# EAGLE design Skaarhoj BI8-1x8slim (EAGLE 6.4)
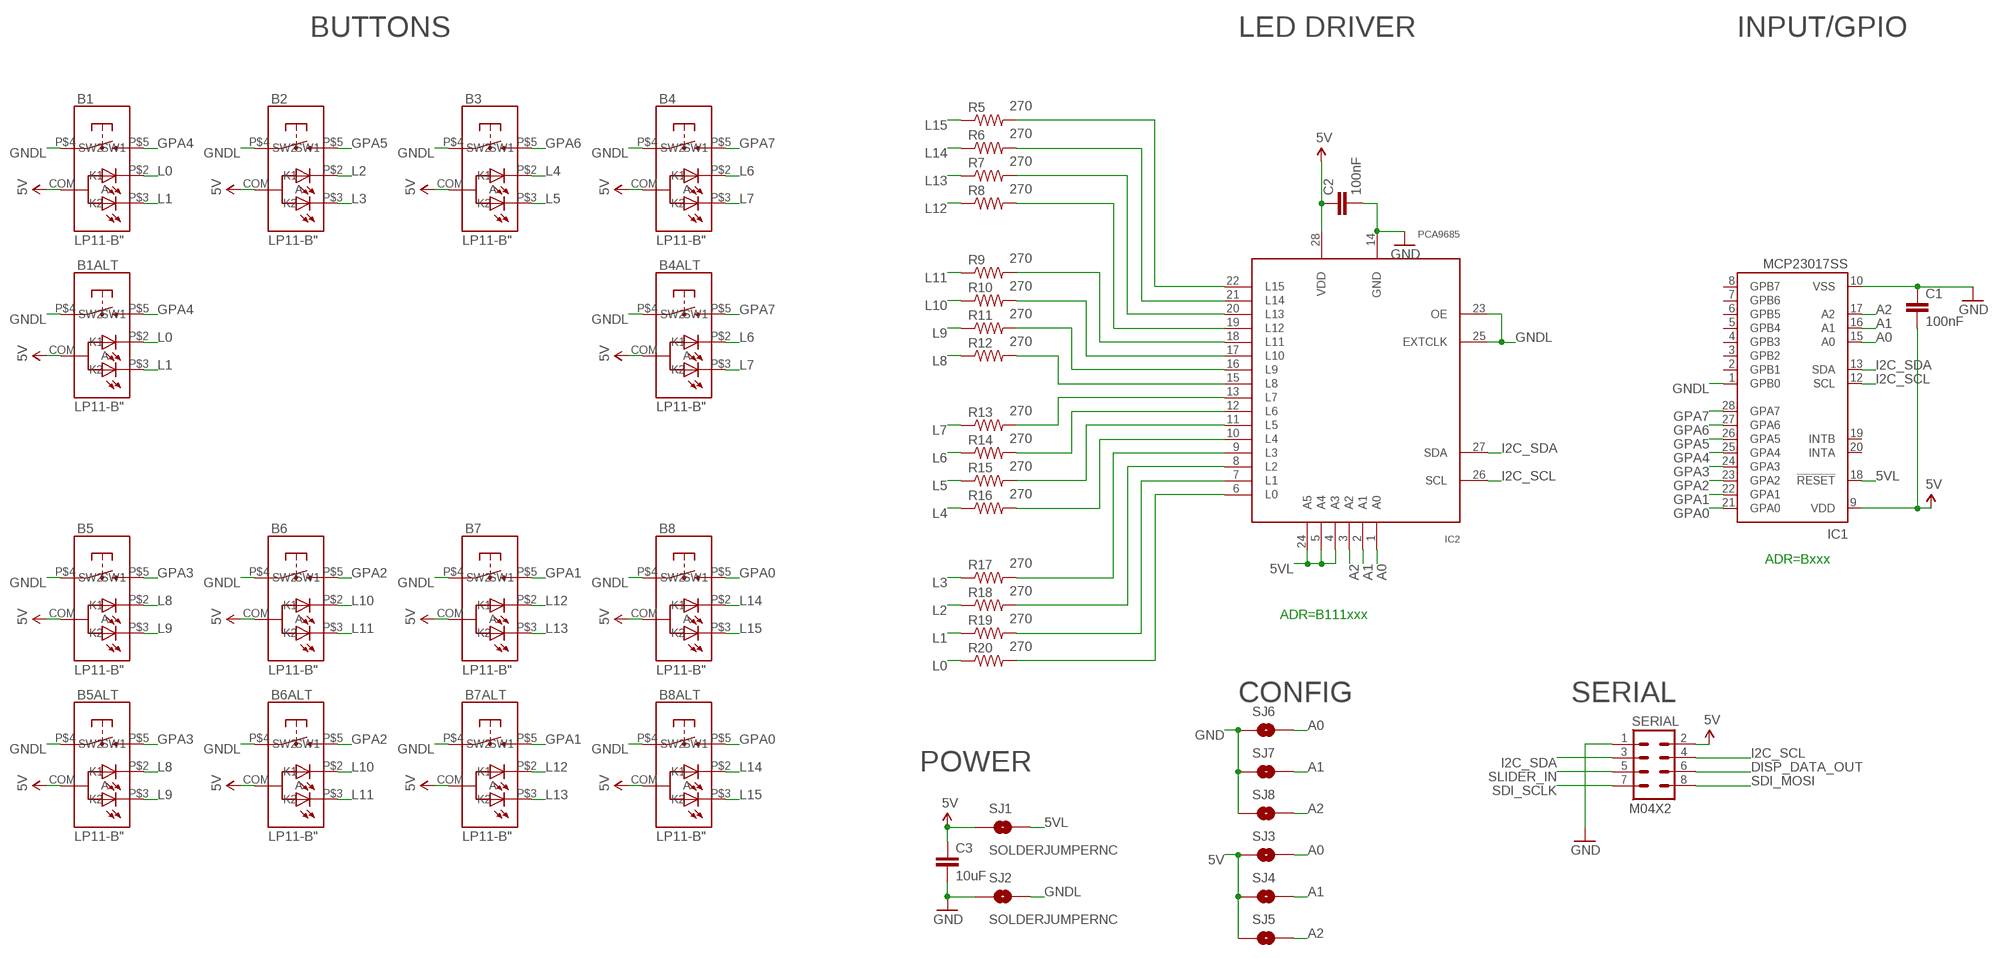
[diagram p0: schematic, sheet 1]

## Parts
B1  LP11-B"  [LP11]
B1ALT  LP11-B"  [LP11]
B2  LP11-B"  [LP11]
B3  LP11-B"  [LP11]
B4  LP11-B"  [LP11]
B4ALT  LP11-B"  [LP11]
B5  LP11-B"  [LP11]
B5ALT  LP11-B"  [LP11]
B6  LP11-B"  [LP11]
B6ALT  LP11-B"  [LP11]
B7  LP11-B"  [LP11]
B7ALT  LP11-B"  [LP11]
B8  LP11-B"  [LP11]
B8ALT  LP11-B"  [LP11]
C1  100nF  CAP0603-CAP  [0603-CAP]
C2  100nF  CAP0603-CAP  [0603-CAP]
C3  10uF  CAP0805  [0805]
IC1  MCP23017SS  [SSOP28]
IC2  PCA9685  [TSSOP28]
R5  270  RESISTOR0603-RES  [0603-RES]
R6  270  RESISTOR0603-RES  [0603-RES]
R7  270  RESISTOR0603-RES  [0603-RES]
R8  270  RESISTOR0603-RES  [0603-RES]
R9  270  RESISTOR0603-RES  [0603-RES]
R10  270  RESISTOR0603-RES  [0603-RES]
R11  270  RESISTOR0603-RES  [0603-RES]
R12  270  RESISTOR0603-RES  [0603-RES]
R13  270  RESISTOR0603-RES  [0603-RES]
R14  270  RESISTOR0603-RES  [0603-RES]
R15  270  RESISTOR0603-RES  [0603-RES]
R16  270  RESISTOR0603-RES  [0603-RES]
R17  270  RESISTOR0603-RES  [0603-RES]
R18  270  RESISTOR0603-RES  [0603-RES]
R19  270  RESISTOR0603-RES  [0603-RES]
R20  270  RESISTOR0603-RES  [0603-RES]
SERIAL  M04X2  [2X4]
SJ1  SOLDERJUMPERNC  [SJ_2S]
SJ2  SOLDERJUMPERNC  [SJ_2S]
SJ3  SOLDERJUMPERNC  [SJ_2S]
SJ4  SOLDERJUMPERNC  [SJ_2S]
SJ5  SOLDERJUMPERNC  [SJ_2S]
SJ6  SOLDERJUMPERNC  [SJ_2S]
SJ7  SOLDERJUMPERNC  [SJ_2S]
SJ8  SOLDERJUMPERNC  [SJ_2S]

## Nets
5V [Power]: B1.COM(A) B1ALT.COM(A) B2.COM(A) B3.COM(A) B4.COM(A) B4ALT.COM(A) B5.COM(A) B5ALT.COM(A) B6.COM(A) B6ALT.COM(A) B7.COM(A) B7ALT.COM(A) B8.COM(A) B8ALT.COM(A) C1.2 C2.1 C3.1 IC1.9(VDD) IC2.28(VDD) SERIAL.2 SJ1.1 SJ3.1 SJ4.1 SJ5.1
5VL: IC1.18(!RESET) IC2.4(A3) IC2.5(A4) IC2.24(A5) SJ1.2
A0: IC1.15(A0) IC2.1(A0) SJ3.2 SJ6.2
A1: IC1.16(A1) IC2.2(A1) SJ4.2 SJ7.2
A2: IC1.17(A2) IC2.3(A2) SJ5.2 SJ8.2
DISP_DATA_OUT: SERIAL.6
GND [Power]: C1.1 C2.2 C3.2 IC1.10(VSS) IC2.14(GND) SERIAL.1 SJ2.1 SJ6.1 SJ7.1 SJ8.1
GNDL: B1.P$4(SW1) B1ALT.P$4(SW1) B2.P$4(SW1) B3.P$4(SW1) B4.P$4(SW1) B4ALT.P$4(SW1) B5.P$4(SW1) B5ALT.P$4(SW1) B6.P$4(SW1) B6ALT.P$4(SW1) B7.P$4(SW1) B7ALT.P$4(SW1) B8.P$4(SW1) B8ALT.P$4(SW1) IC1.1(GPB0) IC2.23(OE) IC2.25(EXTCLK) SJ2.2
GPA0: B8.P$5(SW2) B8ALT.P$5(SW2) IC1.21(GPA0)
GPA1: B7.P$5(SW2) B7ALT.P$5(SW2) IC1.22(GPA1)
GPA2: B6.P$5(SW2) B6ALT.P$5(SW2) IC1.23(GPA2)
GPA3: B5.P$5(SW2) B5ALT.P$5(SW2) IC1.24(GPA3)
GPA4: B1.P$5(SW2) B1ALT.P$5(SW2) IC1.25(GPA4)
GPA5: B2.P$5(SW2) IC1.26(GPA5)
GPA6: B3.P$5(SW2) IC1.27(GPA6)
GPA7: B4.P$5(SW2) B4ALT.P$5(SW2) IC1.28(GPA7)
I2C_SCL: IC1.12(SCL) IC2.26(SCL) SERIAL.4
I2C_SDA: IC1.13(SDA) IC2.27(SDA) SERIAL.3
L0: B1.P$2(K1) B1ALT.P$2(K1) R20.1
L1: B1.P$3(K2) B1ALT.P$3(K2) R19.1
L2: B2.P$2(K1) R18.1
L3: B2.P$3(K2) R17.1
L4: B3.P$2(K1) R16.1
L5: B3.P$3(K2) R15.1
L6: B4.P$2(K1) B4ALT.P$2(K1) R14.1
L7: B4.P$3(K2) B4ALT.P$3(K2) R13.1
L8: B5.P$2(K1) B5ALT.P$2(K1) R12.1
L9: B5.P$3(K2) B5ALT.P$3(K2) R11.1
L10: B6.P$2(K1) B6ALT.P$2(K1) R10.1
L11: B6.P$3(K2) B6ALT.P$3(K2) R9.1
L12: B7.P$2(K1) B7ALT.P$2(K1) R8.1
L13: B7.P$3(K2) B7ALT.P$3(K2) R7.1
L14: B8.P$2(K1) B8ALT.P$2(K1) R6.1
L15: B8.P$3(K2) B8ALT.P$3(K2) R5.1
N$4: IC2.13(L7) R13.2
N$5: IC2.12(L6) R14.2
N$7: IC2.11(L5) R15.2
N$9: IC2.10(L4) R16.2
N$10: IC2.9(L3) R17.2
N$11: IC2.8(L2) R18.2
N$12: IC2.7(L1) R19.2
N$19: IC2.6(L0) R20.2
N$20: IC2.15(L8) R12.2
N$21: IC2.16(L9) R11.2
N$22: IC2.17(L10) R10.2
N$23: IC2.18(L11) R9.2
N$24: IC2.19(L12) R8.2
N$25: IC2.20(L13) R7.2
N$26: IC2.21(L14) R6.2
N$27: IC2.22(L15) R5.2
SDI_MOSI: SERIAL.8
SDI_SCLK: SERIAL.7
SLIDER_IN: SERIAL.5
Unconnected: IC1.2(GPB1) IC1.3(GPB2) IC1.4(GPB3) IC1.5(GPB4) IC1.6(GPB5) IC1.7(GPB6) IC1.8(GPB7) IC1.19(INTB) IC1.20(INTA)

## Notes on the sheet
- BUTTONS | LED DRIVER | INPUT/GPIO
- ADR=Bxxx
- ADR=B111xxx
- CONFIG | SERIAL
- POWER

## Library data of the parts
B1 B1ALT B2-B4 B4ALT B5 B5ALT B6 B6ALT B7 B7ALT B8 B8ALT = SKAARHOJ:LP11-B
C1-C3 = SparkFun:CAP: Capacitor Standard 0603 ceramic capacitor, and 0.1" leaded capacitor.
IC1 = microchip:MCP23017: http://ww1.microchip.com/downloads/en/DeviceDoc/21952a.pdf Source: http://ww1.microchip.com/downloads/en/DeviceDoc/21952a.pdf; MF: MICROCHIP; MPN: MCP23017-E/SS; OC_FARNELL: 1467674; OC_NEWARK: 31K2960
IC2 = wsmith:PCA9685
R5-R20 = SparkFun:RESISTOR: Resistor Basic schematic elements and footprints for 0603, 1206, and PTH resistors.
SERIAL = SparkFun:M04X2
SJ1-SJ8 = SparkFun:SOLDERJUMPER: Solder Jumper Standard SMD solder jumper. Used to automate production. Two varients : Normally Open and Normally Closed are the same, but have different paste layers. NC will have a large amount of paste and should jumper during reflow.

## Net classes
0 default: width 0.203 mm, drill 0.305 mm, clearance 0.203 mm
1 Power: width 0.305 mm, drill 0.61 mm, clearance 0.203 mm

## Board
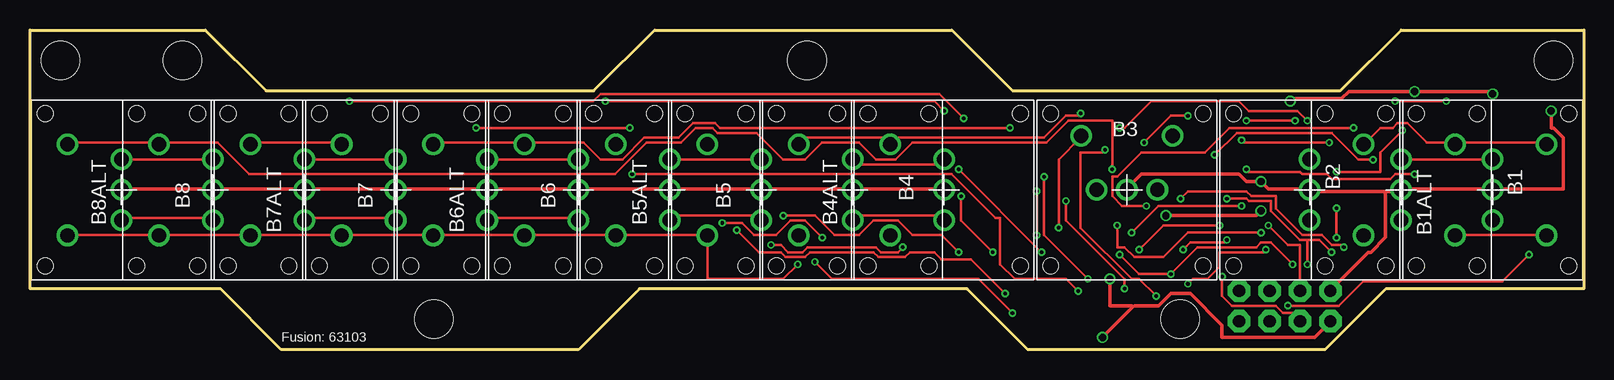
[diagram p1: board, top side]
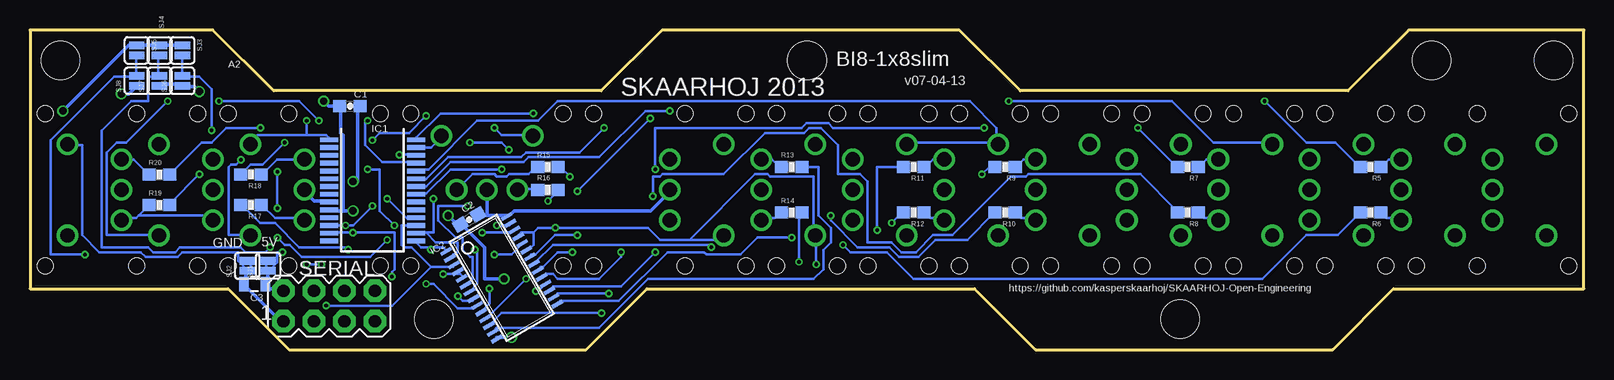
[diagram p2: board, bottom side, seen from below]

Size 129.54 x 26.67 mm. Coordinates in mm from the lower left corner, seen from the top.
Outline: 0,26.67 14.61,26.67 19.68,21.59 46.99,21.59 52.07,26.67 76.83,26.67 81.92,21.59 109.22,21.59 114.3,26.67 129.54,26.67 129.54,5.08 113.03,5.08 107.95,0 83.19,0 78.11,5.08 50.8,5.08 45.72,0 20.95,0 15.88,5.08 0,5.08 0,26.67
Copper layers (1*16): Top 0.035mm / dielectric 1.5mm / Bottom 0.035mm
Design rules "Fusion_eagle_rule_v1.1": minimum track width 6mil, minimum drill 12mil, track to track 6mil, track to pad 6mil, pad to pad 6mil, via to via 6mil, smd to smd 0mil, copper to edge 10mil, drill to drill 10mil, minimum pad ring 10mil, minimum via ring 6mil, stop-mask expansion 2mil, vias tented up to drill 100mil, thermal gap 10mil
Holes 3.2 mm at 2.54,24.13 33.66,2.54 95.89,2.54 64.77,24.13 127,24.13 12.7,24.13

### Footprints (pad centres in the part's own frame; a part is rotated, then mirrored left to right if it is on the bottom)
LP11 = drill 1.2: COM 0,0; P$2 0,2.54; P$3 0,-2.54; P$4 4.5,3.81; P$5 4.5,-3.81 | hole 1.3: -6.35,6.35; 6.35,6.35; 6.35,-6.35; -6.35,-6.35
0603-CAP = smd 1.1 x 1: 1 -0.85,0; 2 0.85,0
0805 = smd 0.8 x 1.2: 1 -0.9,0; 2 0.9,0
SSOP28 = smd 0.4 x 1.5: 1 -4.225,-3.625; 2 -3.575,-3.625; 3 -2.925,-3.625; 4 -2.275,-3.625; 5 -1.625,-3.625; 6 -0.975,-3.625; 7 -0.325,-3.625; 8 0.325,-3.625; 9 0.975,-3.625; 10 1.625,-3.625; 11 2.275,-3.625; 12 2.925,-3.625; 13 3.575,-3.625; 14 4.225,-3.625; 15 4.225,3.625; 16 3.575,3.625; 17 2.925,3.625; 18 2.275,3.625; 19 1.625,3.625; 20 0.975,3.625; 21 0.325,3.625; 22 -0.325,3.625; 23 -0.975,3.625; 24 -1.625,3.625; 25 -2.275,3.625; 26 -2.925,3.625; 27 -3.575,3.625; 28 -4.225,3.625
TSSOP28 = smd 0.305 x 0.991: 1 -4.225,-2.918; 2 -3.575,-2.918; 3 -2.925,-2.918; 4 -2.275,-2.918; 5 -1.625,-2.918; 6 -0.975,-2.918; 7 -0.325,-2.918; 8 0.325,-2.918; 9 0.975,-2.918; 10 1.625,-2.918; 11 2.275,-2.918; 12 2.925,-2.918; 13 3.575,-2.918; 14 4.225,-2.918; 15 4.225,2.918; 16 3.575,2.918; 17 2.925,2.918; 18 2.275,2.918; 19 1.625,2.918; 20 0.975,2.918; 21 0.325,2.918; 22 -0.325,2.918; 23 -0.975,2.918; 24 -1.625,2.918; 25 -2.275,2.918; 26 -2.925,2.918; 27 -3.575,2.918; 28 -4.225,2.918
0603-RES = smd 1.1 x 1: 1 -0.85,0; 2 0.85,0
2X4 = drill 1.016 pad 1.88 octagon: 1 -3.81,-1.27; 2 -3.81,1.27; 3 -1.27,-1.27; 4 -1.27,1.27; 5 1.27,-1.27; 6 1.27,1.27; 7 3.81,-1.27; 8 3.81,1.27
SJ_2S = smd 0.635 x 1.27: 1 -0.412,0; 2 0.412,0

### Placement (x,y rotation side)
B1  121.92,13.34 0 top
B1ALT  114.3,13.34 0 top
B2  106.68,13.34 0 top
B3  91.44,13.34 90 top
B4  76.2,13.34 180 top
B4ALT  68.58,13.34 180 top
B5  60.96,13.34 180 top
B5ALT  53.34,13.34 180 top
B6  45.72,13.34 180 top
B6ALT  38.1,13.34 180 top
B7  30.48,13.34 180 top
B7ALT  22.86,13.34 180 top
B8  15.24,13.34 180 top
B8ALT  7.62,13.34 180 top
C1  102.87,20.32 0 bottom
C2  92.94,10.85 210 bottom
C3  110.82,5.46 180 bottom
IC1  100.99,13.28 270 bottom
IC2  90.22,5.99 300 bottom
R5  17.78,15.24 180 bottom
R6  17.78,11.43 180 bottom
R7  33.02,15.24 180 bottom
R8  33.02,11.43 180 bottom
R9  48.26,15.24 180 bottom
R10  48.26,11.43 180 bottom
R11  55.88,15.24 180 bottom
R12  55.88,11.43 180 bottom
R13  66.04,15.24 0 bottom
R14  66.04,11.43 0 bottom
R15  86.36,15.24 0 bottom
R16  86.36,13.34 0 bottom
R17  111.12,12.06 180 bottom
R18  111.12,14.61 180 bottom
R19  118.75,12.06 0 bottom
R20  118.75,14.61 0 bottom
SERIAL  104.6,3.63 0 bottom
SJ1  109.68,6.99 90 bottom
SJ2  111.43,6.99 90 bottom
SJ3  116.84,24.97 270 bottom
SJ4  118.75,24.97 270 bottom
SJ5  120.65,24.97 270 bottom
SJ6  116.84,22.43 90 bottom
SJ7  118.75,22.43 90 bottom
SJ8  120.65,22.43 90 bottom

### Tracks (layer width: path | path; a pad name or v marks a point on that pad's centre or on a via)
5V  (via drill 0.61)
  Top 0.305: B3.COM 91.44,13.41 92.66,14.63 100.79,14.63 101.4,14.02 v102.62,14.02 103.23,13.41 106.68,13.41 B2.COM 106.68,13.21 112.98,13.21 | v126.8,19.91 126.8,18.49 127,18.49 127.81,17.68 127.81,13.41 121.92,13.41 | 121.92,13.41 114.4,13.41 B1ALT.COM 114.2,13.21 112.98,13.21 | 121.92,13.41 B1.COM | 112.98,13.21 112.98,9.35 111.76,8.13 111.56,8.13 108.51,5.08 SERIAL.2 | B4.COM 76.2,13.41 68.68,13.41 B4ALT.COM 68.48,13.41 60.96,13.41 | 60.96,13.41 53.44,13.41 B5ALT.COM 53.24,13.41 45.72,13.41 | 45.72,13.41 38.2,13.41 B6ALT.COM 38,13.41 30.48,13.41 | 15.24,13.41 7.72,13.41 B8ALT.COM | 30.48,13.41 22.96,13.41 B7ALT.COM 22.76,13.41 15.24,13.41 | 15.24,13.41 B8.COM | 30.48,13.41 B7.COM | 45.72,13.41 B6.COM | 60.96,13.41 B5.COM
  Bottom 0.305: 91.44,11.18 92.05,11.18 C2.1 | 91.44,11.18 89.81,11.18 IC2.28 89.61,11.18 89.2,11.58 77.83,11.58 76.2,13.21 B4.COM | B3.COM 91.44,11.18 | v102.62,14.02 102.21,14.02 102.21,20.32 C1.2 | IC1.9 104.65,12.39 105.87,12.39 106.68,13.21 B2.COM | SJ1.1 109.73,6.5 109.73,5.49 C3.1 109.73,5.28 109.53,5.08 108.51,5.08 SERIAL.2 | SJ3.1 116.84,25.4 118.67,25.4 SJ4.1 118.87,25.4 120.5,25.4 SJ5.1 120.7,25.4 121.31,25.4 v126.8,19.91
5VL  (via drill 0.3)
  Top 0.203: v90.83,7.92 92.46,6.3 v95.1,6.3 97.33,8.53 102.21,8.53 102.62,8.94 103.43,8.94 v105.26,7.11 | v108.51,8.13 107.49,9.14 106.48,9.14 | 106.48,9.14 105.87,9.14 103.43,11.58 103.43,12.39 101.6,12.39 101.4,12.6 v99.77,12.6 | 106.48,9.14 v106.48,7.11
  Bottom 0.203: 93.67,6.3 93.88,6.5 IC2.4 | 93.67,6.3 93.47,6.1 IC2.5 | v90.83,7.92 89.41,7.92 88.59,8.74 IC2.24 | 93.67,6.3 v95.1,6.3 | v108.51,8.13 108.92,8.13 108.92,7.29 109.86,6.35 109.86,7.22 SJ1.2 109.53,7.52 | v99.77,12.6 98.15,10.97 97.54,10.97 IC1.18 | v106.48,7.11 v105.26,7.11
A0  (via drill 0.3)
  Top 0.203: v114.4,18.29 112.57,16.46 112.57,14.83 v108.92,14.83 | v108.92,9.35 v108.92,11.79 | v99.77,9.14 99.57,8.94 96.72,8.94 v96.11,8.33
  Bottom 0.203: SJ3.2 SJ6.2 116.84,22.76 115.42,22.76 114.4,21.74 v114.4,18.29 | 96.11,8.53 96.93,8.53 97.33,8.94 IC1.15 | 96.11,8.53 95.1,8.53 94.89,8.33 IC2.1 | v108.92,11.79 v108.92,14.83 | v108.92,9.35 108.31,8.74 107.9,8.74 106.88,7.72 101.19,7.72 v99.77,9.14 | 96.11,8.53 v96.11,8.33
A1  (via drill 0.3)
  Top 0.203: v109.53,8.53 109.32,8.74 108.51,8.74 107.7,9.55 106.07,9.55 103.83,11.79 103.83,12.8 101.8,12.8 101.4,13.21 96.52,13.21 v95.91,12.6
  Bottom 0.203: SJ4.2 118.87,24.38 118.87,22.96 SJ7.2 118.87,22.76 119.48,22.76 119.69,22.55 119.69,20.73 121.11,20.73 123.55,18.29 123.55,8.53 119.69,8.53 119.28,8.13 117.45,8.13 117.04,8.53 111.96,8.53 111.56,8.13 109.93,8.13 v109.53,8.53 | 96.52,9.75 95.71,8.94 93.88,8.94 93.88,8.13 94.08,7.92 94.28,7.92 94.49,7.72 IC2.2 | 96.52,9.75 97.33,9.75 IC1.16 | v95.91,12.6 95.91,9.75 96.52,9.75
A2  (via drill 0.3)
  Top 0.203: v124.97,7.92 122.73,5.69 111.15,5.69 109.12,3.66 v104.85,3.66
  Bottom 0.203: SJ5.2 120.7,24.38 120.7,22.96 SJ8.2 120.7,22.76 122.53,22.76 127.81,17.48 127.81,7.92 v124.97,7.92 | 96.11,6.91 94.28,6.91 IC2.3 | 96.11,6.91 97.74,8.53 98.35,8.53 98.55,8.74 98.55,10.36 97.54,10.36 IC1.17 | v104.85,3.66 99.36,3.66 96.11,6.91
GND  (via drill 0.61)
  Top 0.305: v121.92,21.34 121.72,21.54 v115.42,21.54 109.93,21.54 109.32,20.93 105.26,20.93 v105.05,20.73 | 91.95,3.56 92.05,3.66 94.08,3.66 95.1,4.67 96.72,4.67 99.36,2.03 99.36,1.02 107.09,1.02 108.31,2.23 SERIAL.1 | 91.95,3.56 v89.41,1.02 | v90.02,5.89 90.02,3.66 91.85,3.66 91.95,3.56 | v102.62,11.58 102.21,11.18 v94.69,11.18
  Bottom 0.305: SJ7.1 118.67,22.15 116.84,22.15 SJ6.1 116.84,21.95 115.82,21.95 v115.42,21.54 | v121.92,21.34 121.31,21.34 120.7,21.95 SJ8.1 | 103.43,11.58 103.43,17.88 103.63,18.09 103.63,20.32 C1.1 104.65,20.32 v105.05,20.73 | 103.43,11.58 104.44,11.58 IC1.10 | SJ2.1 111.56,6.5 111.56,5.49 C3.2 111.56,5.28 108.71,2.44 108.51,2.44 SERIAL.1 | v89.41,1.02 90.63,1.02 IC2.14 | v90.02,5.89 91.64,5.89 91.64,8.53 93.47,10.36 C2.2 93.67,10.57 94.08,10.57 v94.69,11.18 | v102.62,11.58 103.43,11.58
GNDL  (via drill 0.3)
  Top 0.203: B8ALT.P$4 3.25,9.55 10.57,9.55 B8.P$4 10.77,9.55 18.29,9.55 B7ALT.P$4 18.49,9.55 25.81,9.55 B7.P$4 26.01,9.55 33.53,9.55 B6ALT.P$4 33.73,9.55 41.05,9.55 B6.P$4 41.25,9.55 48.77,9.55 B5ALT.P$4 48.97,9.55 56.29,9.55 B5.P$4 56.49,9.35 56.49,5.89 62.79,5.89 v64.01,7.11 | B1.P$4 126.39,17.27 118.87,17.27 B1ALT.P$4 118.67,17.27 116.43,17.27 114.81,18.9 114,18.9 113.59,18.49 112.57,18.49 111.35,17.27 B2.P$4 | v85.75,10.16 85.75,15.85 87.58,17.68 B3.P$4 | v106.48,19.1 105.66,19.91 101.6,19.91 100.79,20.73 93.47,20.73 91.24,18.49 v90.83,18.49
  Bottom 0.203: 106.48,17.88 110.54,17.88 111.15,17.27 B2.P$4 | 106.48,17.88 104.85,17.88 104.65,17.68 IC1.1 | 111.56,7.52 SJ2.2 111.12,7.09 111.12,6.35 112.17,7.39 112.17,8.13 116.84,8.13 117.25,7.72 119.89,7.72 120.29,8.13 123.75,8.13 125.17,9.55 125.17,17.07 126.39,17.07 B1.P$4 | 87.58,9.75 87.58,8.74 87.99,8.33 IC2.23 | 87.58,9.75 88.59,9.75 88.8,9.55 IC2.25 | 87.58,9.75 87.17,10.16 v85.75,10.16 78.03,10.16 77.01,9.14 74.57,9.14 | 74.57,9.14 71.93,9.14 71.73,9.35 B4.P$4 | 74.57,9.14 69.09,14.63 68.07,14.63 67.87,14.43 64.21,14.43 64.21,9.55 B4ALT.P$4 64.01,9.35 v64.01,7.11 | v106.48,19.1 106.48,17.88 | v90.83,18.49 90.22,17.88 87.78,17.88 B3.P$4
GPA0  (via drill 0.3)
  Top 0.203: v90.22,15.04 90.22,19.1 86.56,19.1 84.73,17.27 73.56,17.27 72.14,15.85 70.51,15.85 69.09,17.27 66.04,17.27 64.62,15.85 62.79,15.85 60.55,18.09 57.3,18.09 56.9,18.49 55.47,18.49 54.25,17.27 51.41,17.27 48.77,14.63 18.29,14.63 15.65,17.27 10.77,17.27 B8.P$5 10.57,17.27 3.25,17.27 B8ALT.P$5
  Bottom 0.203: v90.22,15.04 94.49,15.04 96.52,13.01 97.33,13.01 IC1.21
GPA1  (via drill 0.3)
  Top 0.203: v76.2,19.91 75.39,20.73 v47.95,20.73 | B7ALT.P$5 18.49,17.27 25.81,17.27 B7.P$5
  Bottom 0.203: v76.2,19.91 78.23,19.91 82.09,16.05 87.99,16.05 88.39,15.65 94.49,15.65 96.52,13.61 97.33,13.61 IC1.22 | v47.95,20.73 34.34,20.73 30.89,17.27 26.01,17.27 B7.P$5
GPA2  (via drill 0.3)
  Top 0.203: v81.69,18.49 57.51,18.49 57.1,18.9 55.27,18.9 54.05,17.68 51.21,17.68 49.38,15.85 47.55,15.85 46.13,17.27 41.25,17.27 B6.P$5 41.05,17.27 33.73,17.27 B6ALT.P$5
  Bottom 0.203: v81.69,18.49 83.72,16.46 88.19,16.46 88.59,16.05 94.69,16.05 96.52,14.22 97.33,14.22 IC1.23
GPA3
  Bottom 0.203: 48.97,17.27 48.97,18.49 51.21,20.73 85.55,20.73 87.17,19.1 92.25,19.1 96.32,15.04 97.33,15.04 IC1.24 | 48.97,17.27 56.29,17.27 B5.P$5 | 48.97,17.27 B5ALT.P$5
GPA4  (via drill 0.3)
  Top 0.203: v105.46,19.1 v101.4,19.1 | v118.06,20.73 v113.79,20.73 | B1.P$5 126.39,9.55 118.87,9.55 B1ALT.P$5
  Bottom 0.203: v101.4,19.1 101.6,19.1 101.6,17.07 100.18,15.65 97.54,15.65 IC1.25 | v105.46,19.1 107.09,20.73 v113.79,20.73 | v118.06,20.73 121.51,17.27 122.33,17.27 123.14,16.46 123.14,9.55 118.87,9.55 B1ALT.P$5
GPA5  (via drill 0.3)
  Top 0.203: v98.75,16.26 100.58,18.09 108.51,18.09 110.74,15.85 v111.96,15.85
  Bottom 0.203: v98.75,16.26 97.54,16.26 IC1.26 | v111.96,15.85 112.37,15.44 112.78,15.44 112.98,15.24 112.98,9.55 111.35,9.55 B2.P$5
GPA6
  Bottom 0.203: IC1.27 97.33,16.87 96.11,16.87 95.3,17.68 B3.P$5
GPA7  (via drill 0.3)
  Top 0.203: v87.58,19.71 87.38,19.51 86.36,19.51 84.53,17.68 72.14,17.68 | 72.14,17.68 71.73,17.27 B4.P$5 72.14,17.68 | 72.14,17.68 64.62,17.68 64.21,17.27 B4ALT.P$5
  Bottom 0.203: v87.58,19.71 95.3,19.71 97.33,17.68 IC1.28
I2C_SCL  (via drill 0.3)
  Top 0.203: v91.85,9.75 94.08,11.99 v100.99,11.99 | SERIAL.4 105.87,8.74 104.85,8.74 v103.23,10.36
  Bottom 0.203: v91.85,9.75 89.41,9.75 89.2,9.96 IC2.26 | v100.99,11.99 102.62,10.36 v103.23,10.36 104.44,10.36 IC1.12
I2C_SDA  (via drill 0.3)
  Top 0.203: v90.63,10.36 90.63,8.53 91.24,8.53 92.05,7.72 94.49,7.72 96.52,9.75 v102.62,9.75 | v99.36,6.1 99.36,4.47 100.18,3.66 103.83,3.66 104.44,3.05 105.26,3.05 105.87,2.44 SERIAL.3
  Bottom 0.203: v90.63,10.36 89.61,10.36 IC2.27 | IC1.13 104.44,9.75 v102.62,9.75 99.16,9.75 99.16,6.71 99.36,6.5 v99.36,6.1
L0
  Top 0.203: B1ALT.P$2 114.4,15.85 121.92,15.85 B1.P$2
  Bottom 0.203: R20.1 119.69,14.63 120.9,15.85 121.92,15.85 B1.P$2
L1
  Bottom 0.203: 120.5,11.18 120.7,10.97 121.92,10.97 B1.P$3 | 120.5,11.18 119.69,11.99 R19.1 | 120.5,11.18 114.61,11.18 114.4,10.97 B1ALT.P$3
L2
  Bottom 0.203: R18.1 110.13,14.63 108.92,15.85 106.68,15.85 B2.P$2
L3
  Bottom 0.203: R17.1 110.13,11.99 109.12,10.97 106.68,10.97 B2.P$3
L4
  Bottom 0.203: R16.1 87.38,13.41 88.8,13.41 B3.P$2
L5
  Bottom 0.203: R15.1 87.38,15.24 87.99,14.63 89.61,14.63 89.81,14.43 90.63,14.43 90.83,14.63 92.66,14.63 93.88,13.41 B3.P$3
L6
  Top 0.203: B4ALT.P$2 68.68,10.97 68.89,11.18 76,11.18 76.2,10.97 B4.P$2
  Bottom 0.203: R14.1 67.06,11.38 67.46,10.97 68.48,10.97 B4ALT.P$2
L7
  Top 0.203: B4ALT.P$3 68.68,15.85 69.09,15.44 75.79,15.44 76.2,15.85 B4.P$3
  Bottom 0.203: R13.1 67.06,15.24 67.67,15.85 68.48,15.85 B4ALT.P$3
L8
  Top 0.203: B5ALT.P$2 53.44,10.97 53.65,11.18 60.76,11.18 60.96,10.97 B5.P$2
  Bottom 0.203: R12.1 54.86,11.38 54.46,10.97 53.44,10.97 B5ALT.P$2
L9
  Top 0.203: B5ALT.P$3 53.44,15.85 60.96,15.85 B5.P$3
  Bottom 0.203: R11.1 54.86,15.24 54.25,15.85 53.44,15.85 B5ALT.P$3
L10
  Top 0.203: B6ALT.P$2 38.2,10.97 45.72,10.97 B6.P$2
  Bottom 0.203: R10.1 47.35,11.38 46.94,10.97 45.72,10.97 B6.P$2
L11
  Top 0.203: B6ALT.P$3 38.2,15.85 45.72,15.85 B6.P$3
  Bottom 0.203: R9.1 47.35,15.24 46.74,15.85 45.72,15.85 B6.P$3
L12
  Top 0.203: B7ALT.P$2 22.96,10.97 30.48,10.97 B7.P$2
  Bottom 0.203: R8.1 32.11,11.38 31.7,10.97 30.48,10.97 B7.P$2
L13
  Top 0.203: B7ALT.P$3 22.96,15.85 30.48,15.85 B7.P$3
  Bottom 0.203: R7.1 32.11,15.24 31.5,15.85 30.48,15.85 B7.P$3
L14
  Top 0.203: B8ALT.P$2 7.72,10.97 15.24,10.97 B8.P$2
  Bottom 0.203: R6.1 16.87,11.38 16.46,10.97 15.24,10.97 B8.P$2
L15
  Top 0.203: B8ALT.P$3 7.72,15.85 15.24,15.85 B8.P$3
  Bottom 0.203: R5.1 16.87,15.24 16.26,15.85 15.24,15.85 B8.P$3
N$4
  Bottom 0.203: R13.2 63.8,15.24 63.8,11.18 62.79,10.16 62.79,8.94 63.4,8.33 63.4,6.71 64.21,5.89 78.03,5.89 82.09,1.83 90.63,1.83 90.83,1.63 IC2.13
N$5  (via drill 0.3)
  Top 0.203: v81.89,3.05 79.05,5.89 66.85,5.89 v65.43,7.32
  Bottom 0.203: v81.89,3.05 90.22,3.05 91.24,2.03 IC2.12 | v65.43,7.32 65.43,11.38 65.23,11.38 R14.2
N$7  (via drill 0.3)
  Top 0.203: v88.19,5.89 84.53,9.55 v84.53,14.43
  Bottom 0.203: v88.19,5.89 91.44,2.64 IC2.11 | v84.53,14.43 85.34,15.24 R15.2
N$9  (via drill 0.3)
  Top 0.203: v91.24,5.08 91.24,5.89 86.36,10.77 v86.36,12.39
  Bottom 0.203: v91.24,5.08 91.24,3.86 91.85,3.25 IC2.10 | v86.36,12.39 85.55,13.21 R16.2
N$10  (via drill 0.3)
  Top 0.203: v96.52,5.49 96.93,5.89 98.15,5.89 99.16,6.91 99.16,8.13 102.82,8.13 v103.02,8.33
  Bottom 0.203: v96.52,5.49 95.91,5.49 93.88,3.45 92.66,3.45 92.46,3.66 IC2.9 | v103.02,8.33 103.23,8.53 107.09,8.53 109.12,10.57 110.34,10.57 111.76,11.99 111.96,11.99 R17.2
N$11  (via drill 0.3)
  Top 0.203: v93.88,4.47 92.46,5.89 91.85,5.89 87.58,10.16 87.58,16.46 89.41,16.46 v89.61,16.66 | v92.86,17.27 95.1,19.51 v96.52,19.51 | v100.99,17.48 101.19,17.27 v108.31,17.27
  Bottom 0.203: v93.88,4.47 93.47,4.06 92.66,4.06 IC2.8 | v89.61,16.66 90.22,17.27 v92.86,17.27 | v96.52,19.51 97.94,18.09 100.38,18.09 v100.99,17.48 | v108.31,17.27 110.13,15.44 111.15,15.44 111.96,14.63 R18.2
N$12  (via drill 0.3)
  Top 0.203: v92.46,8.33 94.49,10.36 v99.16,10.36 | v101.4,15.04 101.6,14.83 105.87,14.83 106.07,14.63 108.1,14.63 108.51,14.22 113.39,14.22 113.79,14.63 v115.42,14.63
  Bottom 0.203: v92.46,8.33 92.25,8.33 92.25,5.49 92.86,4.88 IC2.7 | v99.16,10.36 100.38,11.58 100.38,15.04 v101.4,15.04 | v115.42,14.63 117.86,12.19 R19.2
N$19  (via drill 0.3)
  Top 0.203: v93.07,11.99 91.03,11.99 90.22,12.8 90.22,14.43 90.63,14.43 92.66,16.46 97.94,16.46 99.97,18.49 v110.34,18.49
  Bottom 0.203: v93.07,11.99 95.5,11.99 95.5,10.77 94.08,9.35 93.47,9.35 93.47,8.33 92.86,7.72 92.66,7.72 92.66,5.89 93.07,5.49 IC2.6 | v110.34,18.49 113.18,18.49 114.4,17.27 115.21,17.27 117.86,14.63 R20.2
N$20  (via drill 0.3)
  Top 0.203: v66.04,9.35 64.62,10.77 63.4,10.77 62.18,9.55 60.35,9.55 59.33,10.57 v57.71,10.57
  Bottom 0.203: v66.04,9.35 68.89,9.35 70.31,7.92 73.15,7.92 73.36,8.13 76.4,8.13 80.47,4.06 85.34,4.06 85.55,3.86 IC2.15 | v57.71,10.57 56.9,11.38 R12.2
N$21  (via drill 0.3)
  Top 0.203: v81.28,4.67 78.44,7.52 76,7.52 75.39,8.13 73.36,8.13 72.95,7.72 70.71,7.72 70.31,8.13 65.02,8.13 64.62,7.72 62.99,7.72 62.59,8.13 60.76,8.13 v58.93,9.96
  Bottom 0.203: v81.28,4.67 85.55,4.67 85.75,4.47 IC2.16 | v58.93,9.96 58.93,15.24 R11.2
N$22  (via drill 0.3)
  Top 0.203: v77.42,8.13 76,9.55 73.56,9.55 72.34,10.77 70.31,10.77 69.09,9.55 67.06,9.55 65.43,11.18 v62.79,11.18
  Bottom 0.203: v77.42,8.13 80.26,5.28 85.95,5.28 86.16,5.08 IC2.17 | v62.79,11.18 62.79,10.77 60.55,8.53 57.91,8.53 57.1,7.72 55.47,7.72 54.05,9.14 51.41,9.14 49.17,11.38 R10.2
N$23  (via drill 0.3)
  Top 0.203: v87.38,4.88 86.36,5.89 82.09,5.89 80.87,7.11 80.87,10.97 80.47,10.97 76.81,14.63 v50.19,14.63
  Bottom 0.203: v87.38,4.88 87.17,4.88 IC2.18 | v50.19,14.63 49.58,15.24 R9.2
N$24  (via drill 0.3)
  Top 0.203: v80.26,8.13 77.62,10.77 v77.62,12.8
  Bottom 0.203: v80.26,8.13 80.26,7.72 82.09,5.89 85.55,5.89 85.95,6.3 86.56,6.3 86.77,6.1 IC2.19 | v77.62,12.8 77.62,14.43 77.01,14.43 76.81,14.63 71.73,14.63 68.28,18.09 65.02,18.09 64.62,18.49 63.6,18.49 62.18,17.07 62.18,14.63 60.35,14.63 59.74,14.02 59.74,8.94 57.71,8.94 56.9,8.13 55.68,8.13 54.25,9.55 52.63,9.55 47.75,14.43 46.53,14.43 46.33,14.63 36.98,14.63 33.93,11.58 R8.2
N$25  (via drill 0.3)
  Top 0.203: v77.42,15.04 v84.33,8.13 | v37.19,18.49 v49.99,18.49
  Bottom 0.203: v84.33,8.13 85.55,8.13 86.77,6.91 86.97,6.91 87.17,6.71 IC2.20 | v77.42,15.04 77.42,18.49 65.23,18.49 64.82,18.9 62.99,18.9 62.59,18.49 v49.99,18.49 | v37.19,18.49 33.93,15.24 R7.2
N$26  (via drill 0.3)
  Top 0.203: v72.75,8.53 72.34,8.13 70.92,8.13 70.51,8.53 64.82,8.53 64.41,8.13 63.2,8.13 62.59,8.74 v61.77,8.74
  Bottom 0.203: v72.75,8.53 72.95,8.74 85.95,8.74 87.38,7.32 IC2.21 | v61.77,8.74 61.16,8.13 58.12,8.13 55.88,5.89 26.82,5.89 23.16,9.55 20.52,9.55 18.69,11.38 R6.2
N$27  (via drill 0.3)
  Top 0.203: v83.92,13.21 v83.92,9.55 | v77.83,19.3 75.79,21.34 47.55,21.34 46.94,20.73 v26.62,20.73
  Bottom 0.203: v83.92,9.55 85.75,9.55 87.38,7.92 87.78,7.92 IC2.22 | v77.83,19.3 v83.92,13.21 | v26.62,20.73 23.16,17.27 20.73,17.27 18.69,15.24 R5.2

### Text on the board
_tsilk: Fusion: 63103
_bsilk: BI8-1x8slim | v07-04-13 | A2 | SKAARHOJ 2013 | 5V | GND | https://github.com/kasperskaarhoj/SKAARHOJ-Open-Engineering | 1